# Altium schematic sheet uC.SchDoc
size A3; SheetNumber: 2; SheetTotal: 5
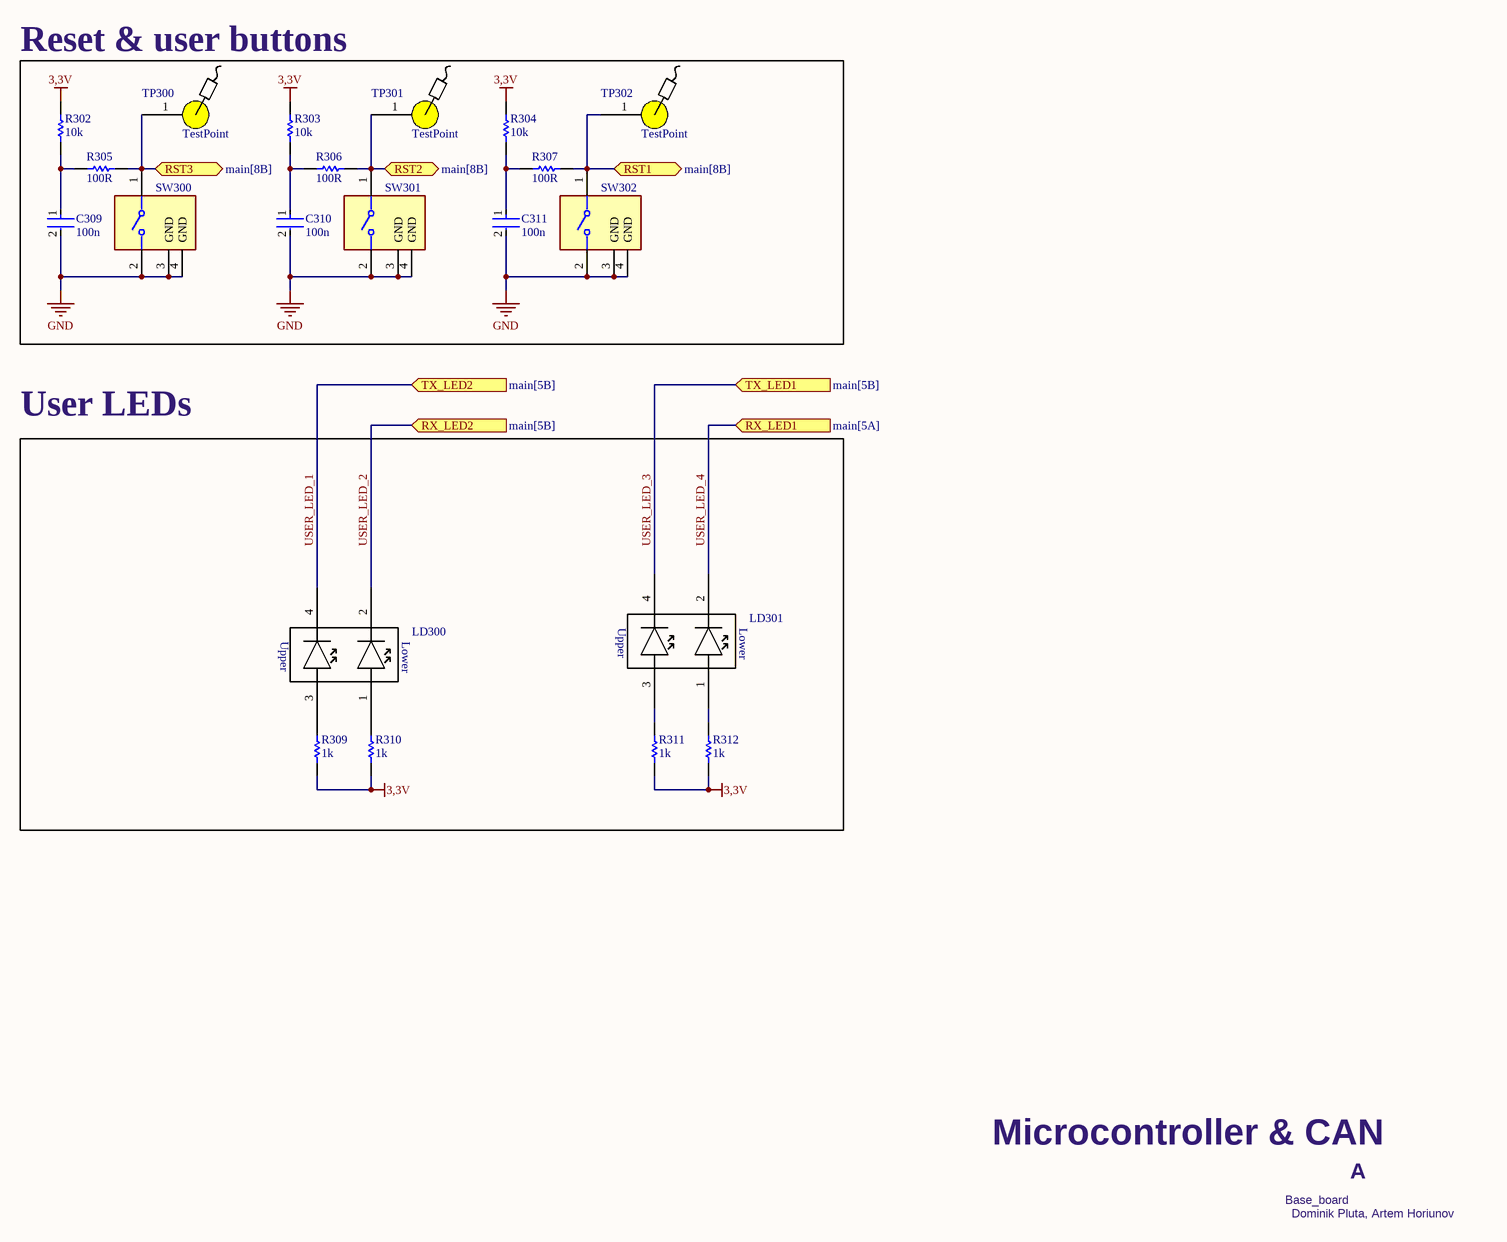
[diagram p0: uC.SchDoc]

## Parts
C309  100n  [FP-C0603C-CF-MFG]
C310  100n  [FP-C0603C-CF-MFG]
C311  100n  [FP-C0603C-CF-MFG]
LD300  (no value)  [LED_HOLDER]
LD301  (no value)  [LED_HOLDER]
R302  10k  [RESC0603(1608)_N]
R303  10k  [RESC0603(1608)_N]
R304  10k  [RESC0603(1608)_N]
R305  100R  [RESC0603(1608)_N]
R306  100R  [RESC0603(1608)_N]
R307  100R  [RESC0603(1608)_N]
R309  1k  [RESC0603(1608)_N]
R310  1k  [RESC0603(1608)_N]
R311  1k  [RESC0603(1608)_N]
R312  1k  [RESC0603(1608)_N]
SW300  B3F-3122  [FP-B3F-3122-MFG]  (value not drawn)
SW301  B3F-3122  [FP-B3F-3122-MFG]  (value not drawn)
SW302  B3F-3122  [FP-B3F-3122-MFG]  (value not drawn)
TP300  TestPoint  [TestPoint]
TP301  TestPoint  [TestPoint]
TP302  TestPoint  [TestPoint]

## Blocks framed on the sheet
Reset & user buttons: C309-C311 R302-R307 SW300-SW302 TP300-TP302
User LEDs: LD300 LD301 R309-R312

## Ports
RST1 (bidir, see main[8B]), RST2 (bidir, see main[8B]), RST3 (bidir, see main[8B]), RX_LED1 (in, see main[5A]), RX_LED2 (in, see main[5B]), TX_LED1 (in, see main[5B]), TX_LED2 (in, see main[5B])

## Nets
3,3V: R302.2 R303.2 R304.2 R309.1 R310.1 R311.1 R312.1
GND: C309.2 C310.2 C311.2 SW300.2 SW300.3(GND) SW300.4(GND) SW301.2 SW301.3(GND) SW301.4(GND) SW302.2 SW302.3(GND) SW302.4(GND)
RST1: R307.1 SW302.1 TP302.1 ; port RST1
RST2: R306.1 SW301.1 TP301.1 ; port RST2
RST3: R305.1 SW300.1 TP300.1 ; port RST3
USER_LED_1: LD300.4 ; port TX_LED2
USER_LED_2: LD300.2 ; port RX_LED2
USER_LED_3: LD301.4 ; port TX_LED1
USER_LED_4: LD301.2 ; port RX_LED1
NetC309_1: C309.1 R302.1 R305.2
NetC310_1: C310.1 R303.1 R306.2
NetC311_1: C311.1 R304.1 R307.2
NetLD300_1: LD300.1 R310.2
NetLD300_3: LD300.3 R309.2
NetLD301_1: LD301.1 R312.2
NetLD301_3: LD301.3 R311.2

## Notes on the sheet
- Microcontroller & CAN
- Base_board
- A
- Dominik Pluta, Artem Horiunov
- (in symbol DoubleStack_Side_Led_3mm) Upper; Lower

## Library data of the parts
C309-C311 = CMP-2006-03061-2: CAP CER 0.1UF 50V X7R 0603; Manufacturer: KEMET; Manufacturer Part Number: C0603C104K5RACTU; Tolerance: 0.1; Temperature Coefficient: 30ppm/°C; Material: Ceramic; Automotive Grade: Grade 1; Value: 0.10 μF; Temperature: -55°C to +125°C; RoHS: TRUE; Temperature Range High: +125°C; Lead Free: Yes; Octopart: https://octopart.com/c0603c104k5ractu-kemet-139244; Digikey Description: CAP CER 0.1UF 50V X7R 0603; Category: Cap; Package: C0603C-CF; ComponentLink2Description: Datasheet; Temperature Range Low: -55°C; Device Class L1: Passive Components; Voltage Rating: 50 V; Automotive: Yes; Device Class L3: Ceramic Capacitors; ComponentLink2URL: https://api.kemet.com/component-edge/download/datasheet/C0603C100J5GACAUTO.pdf; Capacitance: 0.10 μF; Device Class L2: Capacitors; Temperature Characteristic: X7R; Height: 0.87mm
LD300 LD301 = DoubleStack_Side_Led_3mm
R302-R307 = CMP-1012-00081-1: 0.1W 5% 0603 (1608 Metric)  SMD; Case-Metric: 1608; Value: 2000.00 Ohm; Case-EIA: 0603; Tolerance: 5 %; Technology: SMT; Power: 0.1 W
R309-R312 = CMP-1012-00081-1: 0.1W 1% 0603 (1608 Metric)  SMD; Tolerance: 5 %; Case-Metric: 1608; Value: 2000.00 Ohm; Case-EIA: 0603; Technology: SMT; Power: 0.1 W
SW300-SW302 = CMP-08834-000053-1: SWITCH TACTILE SPST-NO 0.05A 24V; Max Current Rating: 50mA; Actuator Type: Standard; Ratings: IP00; Number of Poles: 1; Mechanical Life: 300000Cycles; Illumination Type: Non-Illuminated; Switch Function: Off-Mom; Actuator Color: Grey; Contact Resistance: 100mR; Throw Configuration: SPST; Actuator Length: 1.6mm; Switch Travel: 0.25mm; Operating Force: 1.47N; Weight: 0.25g; Voltage Rating (DC): 24V; Contact Plating: Gold; RoHS Compliant: Yes; Contact Material: Gold; Radiation Hardening: No; Packaging: Bulk; Height: 7.4mm; Min Operating Temperature: -25°C; Electrical Life: 300000Cycles; Depth: 7.85mm; Max Voltage Rating (DC): 24V; Mount: Through Hole; Width: 6.25mm; Current Rating: 50mA; Lead Free: Lead Free; Max Operating Temperature: 70°C; Series: B3F; Contact Current Rating: 50mA; Package Quantity: 1000; Termination: PC Pins; Orientation: Right Angle; Length: 7.3mm